# Altium schematic sheet 原理图.SchDoc
size A4
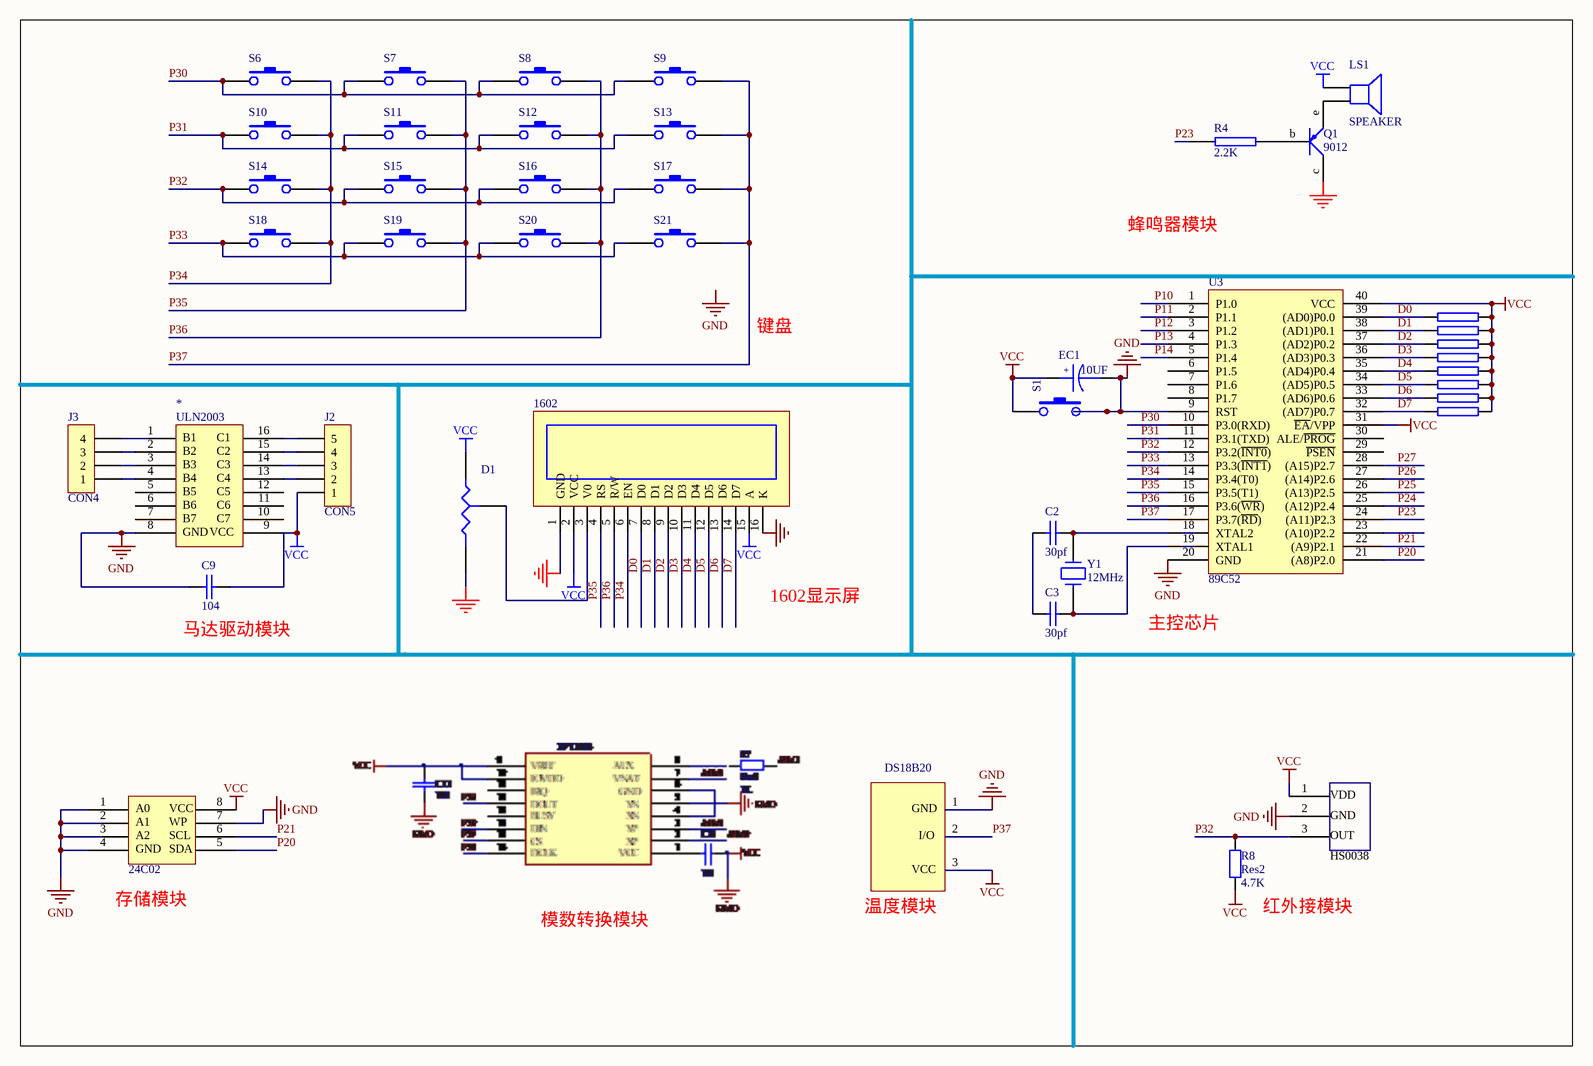
[diagram p0: 原理图.SchDoc]

## Parts
(Parts that share a designator on the sheet are numbered #1, #2 ... from top to bottom, then left to right.)
01  (no value)
02  (no value)
03  (no value)
04  (no value)
05  (no value)
06  (no value)
07  (no value)
08  (no value)
*#1  (no value)
*#2  (no value)
*#3  1  (value not drawn)
?  1602  [LCD1602]
C2  30pf  [C01]
C3  30pf  [C01]
C9  104  [C01]
D1  RESISTOR TAPPED  (value not drawn)
EC1  10UF
J2  CON5  [DG1285-5.0]
J3  CON4  [DG1284-5.0]
LS1  SPEAKER
Q1  9012  [TO-92B]
R4  2.2K  [R-DIP]
R8  Res2  value 4.7K  [AXIAL-0.4]
S1  auxiliary3  [BUTTON_6*6]  (value not drawn)
S6  auxiliary3  [BUTTON_6*6]  (value not drawn)
S7  auxiliary3  [BUTTON_6*6]  (value not drawn)
S8  auxiliary3  [BUTTON_6*6]  (value not drawn)
S9  auxiliary3  [BUTTON_6*6]  (value not drawn)
S10  auxiliary3  [BUTTON_6*6]  (value not drawn)
S11  auxiliary3  [BUTTON_6*6]  (value not drawn)
S12  auxiliary3  [BUTTON_6*6]  (value not drawn)
S13  auxiliary3  [BUTTON_6*6]  (value not drawn)
S14  auxiliary3  [BUTTON_6*6]  (value not drawn)
S15  auxiliary3  [BUTTON_6*6]  (value not drawn)
S16  auxiliary3  [BUTTON_6*6]  (value not drawn)
S17  auxiliary3  [BUTTON_6*6]  (value not drawn)
S18  auxiliary3  [BUTTON_6*6]  (value not drawn)
S19  auxiliary3  [BUTTON_6*6]  (value not drawn)
S20  auxiliary3  [BUTTON_6*6]  (value not drawn)
S21  auxiliary3  [BUTTON_6*6]  (value not drawn)
U3  89C52  [DIP40]
Y1  12MHz  [JZ]

## Nets
GND: ?.1(GND) ?.16(K) C9.2 D1.2(B) EC1.2 Q1.c S1.2 U3.9(RST) U3.20(GND)
VCC: 01.2 02.2 03.2 04.2 05.2 06.2 07.2 08.2 ?.2(VCC) ?.15(A) C9.1 D1.1(A) EC1.1 J2.1 LS1.1 R8.1 S1.1 U3.31(~{EA}/VPP) U3.40(VCC)
D0: 01.1 ?.7(D0) U3.39((AD0)P0.0)
D1: 02.1 ?.8(D1) U3.38((AD1)P0.1)
D2: 03.1 ?.9(D2) U3.37((AD2)P0.2)
D3: 04.1 ?.10(D3) U3.36((AD3)P0.3)
D4: 05.1 ?.11(D4) U3.35((AD4)P0.4)
D5: 06.1 ?.12(D5) U3.34((AD5)P0.5)
D6: 07.1 ?.13(D6) U3.33((AD6)P0.6)
D7: 08.1 ?.14(D7) U3.32((AD7)P0.7)
P10: U3.1(P1.0)
P11: U3.2(P1.1)
P12: U3.3(P1.2)
P13: U3.4(P1.3)
P14: U3.5(P1.4)
P20: U3.21((A8)P2.0)
P21: U3.22((A9)P2.1)
P23: R4.2 U3.24((A11)P2.3)
P24: U3.25((A12)P2.4)
P25: U3.26((A13)P2.5)
P26: U3.27((A14)P2.6)
P27: U3.28((A15)P2.7)
P30: S6.1 S7.1 S8.1 S9.1 U3.10(P3.0(RXD))
P31: S10.1 S11.1 S12.1 S13.1 U3.11(P3.1(TXD))
P32: R8.2 S14.1 S15.1 S16.1 S17.1 U3.12(P3.2(~{INT0}))
P33: S18.1 S19.1 S20.1 S21.1 U3.13(P3.3(~{INT1}))
P34: ?.6(EN) S6.2 S10.2 S14.2 S18.2 U3.14(P3.4(T0))
P35: ?.4(RS) S7.2 S11.2 S15.2 S19.2 U3.15(P3.5(T1))
P36: ?.5(R/W) S8.2 S12.2 S16.2 S20.2 U3.16(P3.6(~{WR}))
P37: S9.2 S13.2 S17.2 S21.2 U3.17(P3.7(~{RD}))
Net?_3: ?.3(V0) D1.3(TAP)
NetC2_1: C2.1 U3.18(XTAL2) Y1.1
NetC2_2: C2.2 C3.2
NetC3_1: C3.1 U3.19(XTAL1) Y1.2
NetLS1_2: LS1.2 Q1.e
NetQ1_b: Q1.b R4.1

Not connected (* = marked no-connect by the designer): *#1 1 2 3 4 5 6 7 8 9 10 11 12 13 14 15 16; *#2 1(0) 2(1) 3(2); *#3 1(32) 2(33) 3(34) 4(35) 5(36) 6(37) 7(38) 8(39); J2 2 3 4 5; J3 1 2 3 4; U3 6(P1.5) 7(P1.6) 8(P1.7) 23((A10)P2.2) 29(~{PSEN}) 30(ALE/~{PROG})

## Notes on the sheet
- 蜂鸣器模块
- 键盘
- (near C9) 马达驱动模块
- 1602显示屏
- 主控芯片
- DS18B20
- 1
- GND
- I/O
- 2
- 3
- (near *#3) 存储模块
- 模数转换模块
- 温度模块
- VCC
- (near R8) 红外接模块
- Labels drawn without touching a wire or pin: GND, VCC
- (in symbol 24C02) A0; VCC; A1; WP; A2; SCL; GND; SDA
- (in symbol HS) VDD; GND; OUT; HS0038
- (in symbol ULN2003) B1; C1; B2; C2; B3; C3; B4; C4; B5; C5; B6; C6; B7; C7; GND; VCC
- (in symbol 电解电容) +

## Library data of the parts
01 02 03 04 05 06 07 08 R4 = RES2
*#1 = ULN2003
*#2 = HS
*#3 = 24C02
? = LCM1602
C2 C3 C9 = CAP: Capacitor
EC1 = 电解电容: Capacitor
Q1 = PNP
R8 = Res2: Resistor; Published: 8-Jun-2000; LatestRevisionDate: 17-Jul-2002; LatestRevisionNote: Re-released for DXP Platform.; PackageReference: AXIAL-0.4; Publisher: Altium Limited
S1 S6-S21 = 微动开关
U3 = AT89C51
Y1 = CRYSTAL